# EAGLE design BLE (EAGLE 7.6.0)
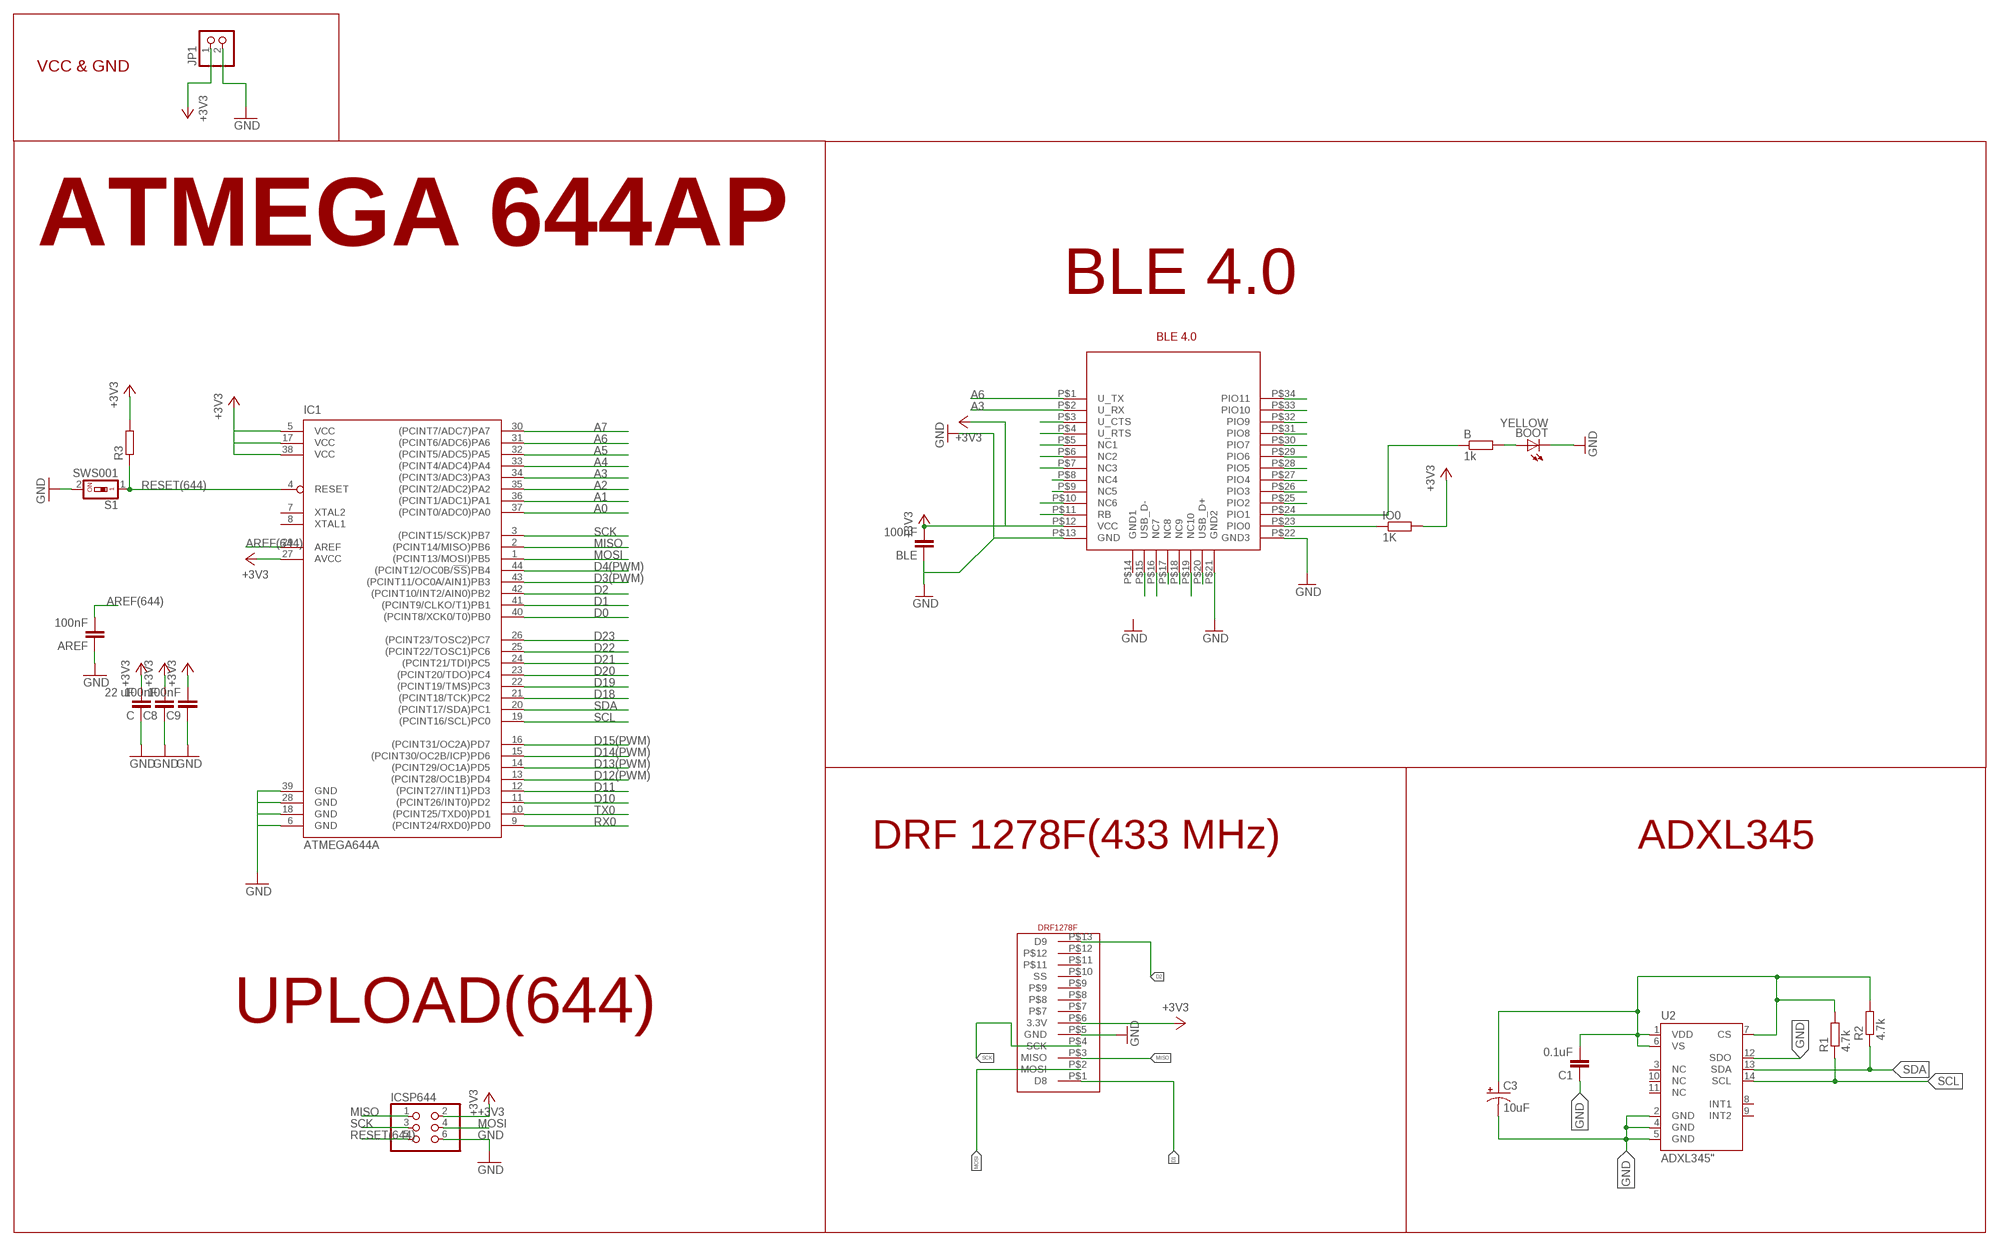
[diagram p0: schematic, sheet 1]

## Parts
AREF  100nF  C-EUC0805  [C0805]
B  1k  R-EU_R0805  [R0805]
BLE  100nF  C-EUC0805  [C0805]
BOOT  YELLOW  LEDCHIP-LED0805  [CHIP-LED0805]
C  22 uF  C-EUC0805  [C0805]
C1  0.1uF  C-EUC0805  [C0805]
C3  10uF  CAP_POL1206  [EIA3216]
C8  100nF  C-EUC0805  [C0805]
C9  100nF  C-EUC0805  [C0805]
IC1  ATMEGA644A  [TQFP44]
ICSP644  PINHD-2X3  [2X03]
IO0  1K  R-EU_R0805  [R0805]
JP1  PINHD-1X2  [1X02]
R1  4.7k  R-EU_R0805  [R0805]
R2  4.7k  R-EU_R0805  [R0805]
R3  R-EU_R0805  [R0805]
S1  SWS001  [SMS-001]
U2  ADXL345"  [ADXL3451:1]
U$1  DRF1278F  [DIP13]
U$6  BLUETOOTH_4.0(13)  [BLUTOOTH_4.0(13)]

## Nets
5V_1: B.2 BOOT.A
+3V3: BLE.2 C8.2 C9.2 C.2 IC1.5(VCC) IC1.17(VCC) IC1.27(AVCC) IC1.38(VCC) ICSP644.2 IO0.2 JP1.1 R3.2 U$1.P$6(3.3V) U$6.P$12(VCC)
A0: IC1.37((PCINT0/ADC0)PA0)
A1: IC1.36((PCINT1/ADC1)PA1)
A2: IC1.35((PCINT2/ADC2)PA2)
A3: IC1.34((PCINT3/ADC3)PA3) U$6.P$2(U_RX)
A4: IC1.33((PCINT4/ADC4)PA4)
A5: IC1.32((PCINT5/ADC5)PA5)
A6: IC1.31((PCINT6/ADC6)PA6) U$6.P$1(U_TX)
A7: IC1.30((PCINT7/ADC7)PA7)
AREF(644): AREF.2 IC1.29(AREF)
D0: IC1.40((PCINT8/XCK0/T0)PB0)
D1: IC1.41((PCINT9/CLKO/T1)PB1) U$1.P$1(D8)
D2: IC1.42((PCINT10/INT2/AIN0)PB2) U$1.P$13(D9)
D3(PWM): IC1.43((PCINT11/OC0A/AIN1)PB3)
D4(PWM): IC1.44((PCINT12/OC0B/!SS!)PB4)
D10: IC1.11((PCINT26/INT0)PD2)
D11: IC1.12((PCINT27/INT1)PD3)
D12(PWM): IC1.13((PCINT28/OC1B)PD4)
D13(PWM): IC1.14((PCINT29/OC1A)PD5)
D14(PWM): IC1.15((PCINT30/OC2B/ICP)PD6)
D15(PWM): IC1.16((PCINT31/OC2A)PD7)
D18: IC1.21((PCINT18/TCK)PC2)
D19: IC1.22((PCINT19/TMS)PC3)
D20: IC1.23((PCINT20/TDO)PC4)
D21: IC1.24((PCINT21/TDI)PC5)
D22: IC1.25((PCINT22/TOSC1)PC6)
D23: IC1.26((PCINT23/TOSC2)PC7)
GND: AREF.1 BLE.1 BOOT.C C1.1 C3.C(-) C8.1 C9.1 C.1 IC1.6(GND) IC1.18(GND) IC1.28(GND) IC1.39(GND) ICSP644.6 JP1.2 S1.2 U2.2(GND) U2.4(GND) U2.5(GND) U2.12(SDO) U$1.P$5(GND) U$6.P$13(GND) U$6.P$21(GND2) U$6.P$22(GND3)
MISO: IC1.2((PCINT14/MISO)PB6) ICSP644.1 U$1.P$3(MISO)
MOSI: IC1.1((PCINT13/MOSI)PB5) ICSP644.4 U$1.P$2(MOSI)
N$3: U$6.P$3(U_CTS)
N$6: C1.2 C3.A(+) R1.2 R2.2 U2.1(VDD) U2.6(VS) U2.7(CS)
N$14: U$6.P$4(U_RTS)
N$28: U$6.P$5(NC1)
N$32: U$6.P$6(NC2)
N$33: U$6.P$7(NC3)
N$34: U$6.P$8(NC4)
N$35: U$6.P$9(NC5)
N$37: U$6.P$10(NC6)
N$38: U$6.P$11(RB)
N$41: U$6.P$15(USB_D-)
N$45: U$6.P$16(NC7)
N$46: U$6.P$17(NC8)
N$47: U$6.P$18(NC9)
N$48: U$6.P$19(NC10)
N$49: U$6.P$20(USB_D+)
N$50: IO0.1 U$6.P$23(PIO0)
N$51: B.1 U$6.P$24(PIO1)
N$52: U$6.P$25(PIO2)
N$53: U$6.P$26(PIO3)
N$54: U$6.P$27(PIO4)
N$55: U$6.P$28(PIO5)
N$56: U$6.P$29(PIO6)
N$57: U$6.P$30(PIO7)
N$58: U$6.P$31(PIO8)
N$59: U$6.P$32(PIO9)
N$60: U$6.P$33(PIO10)
N$61: U$6.P$34(PIO11)
RESET(644): IC1.4(RESET) ICSP644.5 R3.1 S1.1
RX0: IC1.9((PCINT24/RXD0)PD0)
SCK: IC1.3((PCINT15/SCK)PB7) ICSP644.3 U$1.P$4(SCK)
SCL: IC1.19((PCINT16/SCL)PC0) R1.1 U2.14(SCL)
SDA: IC1.20((PCINT17/SDA)PC1) R2.1 U2.13(SDA)
TX0: IC1.10((PCINT25/TXD0)PD1)
Unconnected: IC1.7(XTAL2) IC1.8(XTAL1) U2.3(NC) U2.8(INT1) U2.9(INT2) U2.10(NC) U2.11(NC) U$1.P$7 U$1.P$8 U$1.P$9 U$1.P$10(SS) U$1.P$11 U$1.P$12 U$6.P$14(GND1)

## Notes on the sheet
- VCC & GND
- ATMEGA 644AP
- BLE 4.0
- DRF 1278F(433 MHz) | ADXL345
- UPLOAD(644)

## Library data of the parts
AREF BLE C C1 C8 C9 = rcl:C-EU: CAPACITOR, European symbol
B IO0 R1-R3 = resistor:R-EU_: RESISTOR, European symbol
BOOT = led:LED: LED OSRAM: - CHIPLED LG R971, LG N971, LY N971, LG Q971, LY Q971, LO R971, LY R971 LH N974, LH R974 LS Q976, LO Q976, LY Q976 LO Q996 - Hyper CHIPLED LW Q18S LB Q993, LB Q99A, LB R99A - SideLED LS A670, LO A670, LY A670, LG A670, LP A670 LB A673, LV A673, LT A673, LW A673 LH A674 LY A675 LS A676, LA A676, LO A676, LY A676, LW A676 LS A679, LY A679, LG A679 - Hyper Micro SIDELED® LS Y876, LA Y876, LO Y876, LY Y876 LT Y87S - SmartLED LW L88C, LW L88S LB L89C, LB L89S, LG L890 LS L89K, LO L89K, LY L89K LS L896, LA L896, LO L896, LY L896 - TOPLED LS T670, LO T670, LY T670, LG T670, LP T670 LSG T670, LSP T670, LSY T670, LOP T670, LYG T670 LG T671, LOG T671, LSG T671 LB T673, LV T673, LT T673, LW T673 LH T674 LS T676, LA T676, LO T676, LY T676, LB T676, LH T676, LSB T676, LW T676 LB T67C, LV T67C, LT T67C, LS T67K, LO T67K, LY T67K, LW E67C LS E67B, LA E67B, LO E67B, LY E67B, LB E67C, LV E67C, LT E67C LW T67C LS T679, LY T679, LG T679 LS T770, LO T770, LY T770, LG T770, LP T770 LB T773, LV T773, LT T773, LW T773 LH T774 LS E675, LA E675, LY E675, LS T675 LS T776, LA T776, LO T776, LY T776, LB T776 LHGB T686 LT T68C, LB T68C - Hyper Mini TOPLED® LB M676 - Mini TOPLED Santana® LG M470 LS M47K, LO M47K, LY M47K Source: http://www.osram.convergy.de LUXEON: - LUMILED® LXK2-PW12-R00, LXK2-PW12-S00, LXK2-PW14-U00, LXK2-PW14-V00 LXK2-PM12-R00, LXK2-PM12-S00, LXK2-PM14-U00 LXK2-PE12-Q00, LXK2-PE12-R00, LXK2-PE12-S00, LXK2-PE14-T00, LXK2-PE14-U00 LXK2-PB12-K00, LXK2-PB12-L00, LXK2-PB12-M00, LXK2-PB14-N00, LXK2-PB14-P00, LXK2-PB14-Q00 LXK2-PR12-L00, LXK2-PR12-M00, LXK2-PR14-Q00, LXK2-PR14-R00 LXK2-PD12-Q00, LXK2-PD12-R00, LXK2-PD12-S00 LXK2-PH12-R00, LXK2-PH12-S00 LXK2-PL12-P00, LXK2-PL12-Q00, LXK2-PL12-R00 Source: www.luxeon.com KINGBRIGHT: KA-3528ASYC Source: www.kingbright.com
C3 = SparkFun:CAP_POL: Capacitor Polarized These are standard SMD and PTH capacitors. Normally 10uF, 47uF, and 100uF in electrolytic and tantalum varieties. Always verify the external diameter of the through hole cap, it varies with capacity, voltage, and manufacturer. The EIA devices should be standard.
IC1 = atmel:ATMEGA644: 8-bit Microcontroller with 64K Bytes In-System Programmable Flash Source: http://www.atmel.com/dyn/resources/prod_documents/doc2593.pdf; MPN: ATMEGA644PV-10AU; OC_FARNELL: 1455123; OC_NEWARK: 58M3748
ICSP644 = pinhead:PINHD-2X3: PIN HEADER
JP1 = pinhead:PINHD-1X2: PIN HEADER
S1 = smd-special:SWS001: SMD Dip Switch 1 pol.
U2 = SparkFun-Sensors:ADXL345: 3-axis SPI/I2C 2/4/8/16g accelerometer; PROD_ID: IC-09097
U$1 = small_header:DRF1278F
U$6 = BLUETOOTH_4.0(13P):BLUETOOTH_4.0(13)

## Board
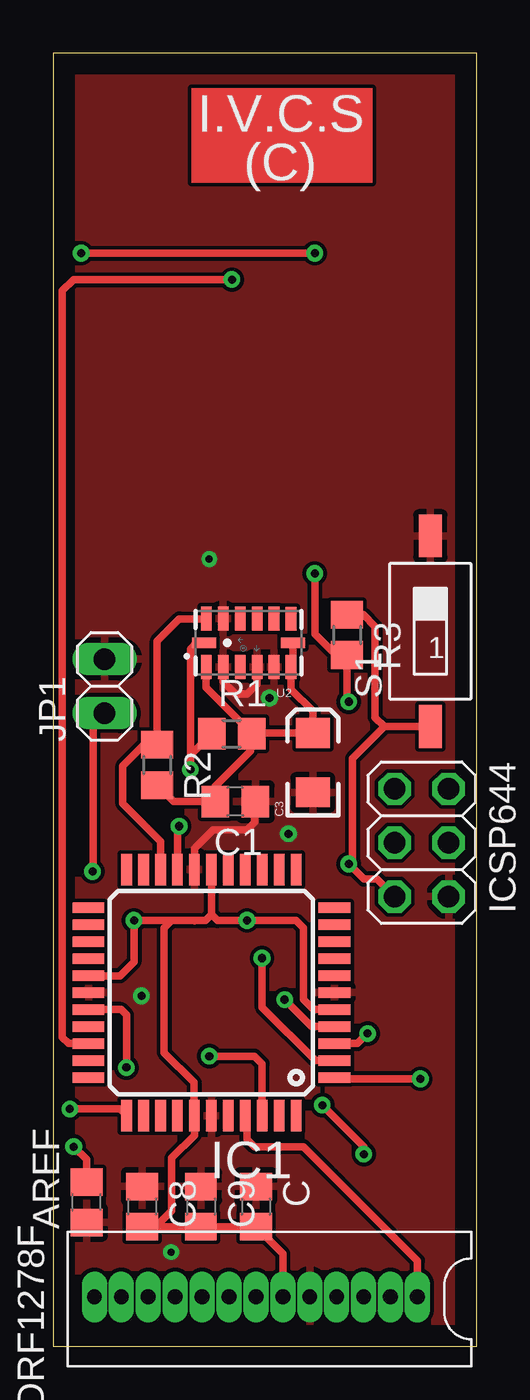
[diagram p1: board, top side]
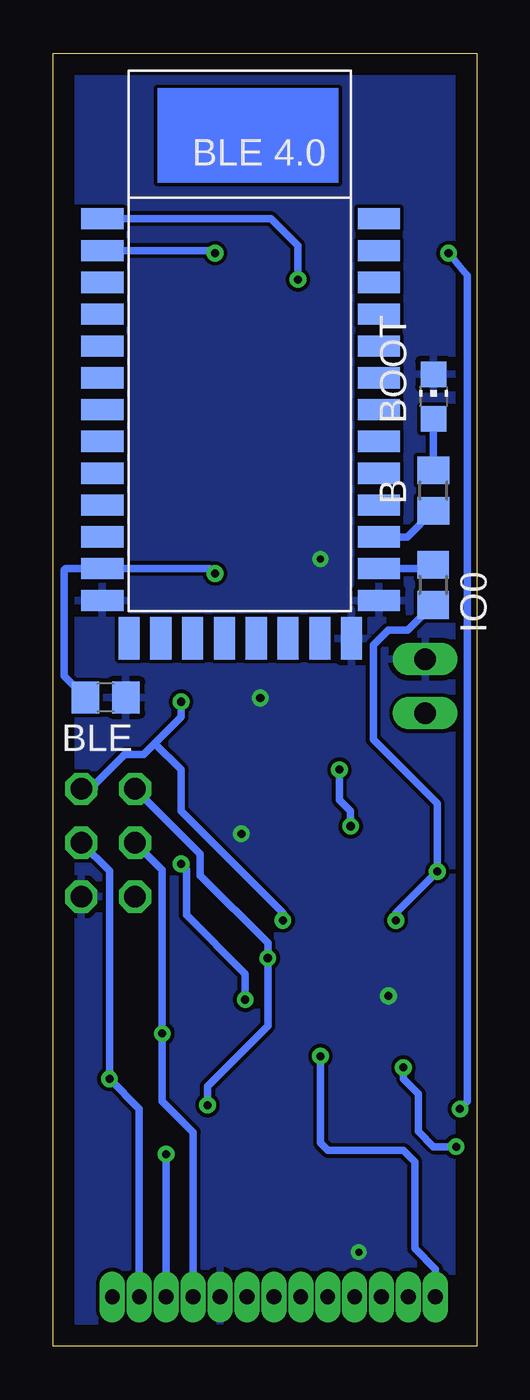
[diagram p2: board, bottom side, seen from below]

Size 20 x 61 mm. Coordinates in mm from the lower left corner, seen from the top.
Outline: 20,0 20,61 0,61 0,0 20,0
Copper layers (1*16): Top 0.035mm / dielectric 1.5mm / Bottom 0.035mm
Design rules "default *": minimum track width 10mil, minimum drill 13mil, track to track 7mil, track to pad 7mil, pad to pad 7mil, via to via 7mil, smd to smd 7mil, copper to edge 40mil, drill to drill 8mil, minimum pad ring 10mil, minimum via ring 8mil, stop-mask expansion 4mil, vias tented up to drill 0mil, thermal gap 10mil

### Footprints (pad centres in the part's own frame; a part is rotated, then mirrored left to right if it is on the bottom)
C0805 = smd 1.3 x 1.5: 1 -0.95,0; 2 0.95,0
R0805 = smd 1.3 x 1.5: 1 -0.95,0; 2 0.95,0
CHIP-LED0805 = smd 1.2 x 1.2: A 0,-1.05; C 0,1.05
EIA3216 = smd 1.4 x 1.6: A 1.4,0; C -1.4,0
TQFP44 = smd 1.5 x 0.5: 1 -5.8,4; 2 -5.8,3.2; 3 -5.8,2.4; 4 -5.8,1.6; 5 -5.8,0.8; 6 -5.8,0; 7 -5.8,-0.8; 8 -5.8,-1.6; 9 -5.8,-2.4; 10 -5.8,-3.2; 11 -5.8,-4; 23 5.8,-4; 24 5.8,-3.2; 25 5.8,-2.4; 26 5.8,-1.6; 27 5.8,-0.8; 28 5.8,0; 29 5.8,0.8; 30 5.8,1.6; 31 5.8,2.4; 32 5.8,3.2; 33 5.8,4 | smd 0.5 x 1.5: 12 -4,-5.8; 13 -3.2,-5.8; 14 -2.4,-5.8; 15 -1.6,-5.8; 16 -0.8,-5.8; 17 0,-5.8; 18 0.8,-5.8; 19 1.6,-5.8; 20 2.4,-5.8; 21 3.2,-5.8; 22 4,-5.8; 34 4,5.8; 35 3.2,5.8; 36 2.4,5.8; 37 1.6,5.8; 38 0.8,5.8; 39 0,5.8; 40 -0.8,5.8; 41 -1.6,5.8; 42 -2.4,5.8; 43 -3.2,5.8; 44 -4,5.8
2X03 = drill 1.016 octagon: 1 -2.54,-1.27; 2 -2.54,1.27; 3 0,-1.27; 4 0,1.27; 5 2.54,-1.27; 6 2.54,1.27
1X02 = drill 1.016 long: 1 -1.27,0; 2 1.27,0
SMS-001 = smd 1.092 x 2.007: 1 0,-4.496; 2 0,4.496
ADXL3451:1 = smd 0.5 x 1.124: 1 2,1.138; 2 1.2,1.138; 3 0.4,1.138; 4 -0.4,1.138; 5 -1.2,1.138; 6 -2,1.138; 8 -2,-1.13; 9 -1.2,-1.138; 10 -0.4,-1.138; 11 0.4,-1.138; 12 1.2,-1.138; 13 2,-1.138 | smd 1.124 x 0.5: 7 -2.1,0; 14 2.1,0
DIP13 = drill 0.7 long: P$1 -2,0; P$2 -2,-1.27; P$3 -2,-2.54; P$4 -2,-3.81; P$5 -2,-5.08; P$6 -2,-6.35; P$7 -2,-7.62; P$8 -2,-8.89; P$9 -2,-10.16; P$10 -2,-11.43; P$11 -2,-12.7; P$12 -2,-13.97; P$13 -2,-15.24
BLUTOOTH_4.0(13) = smd 2 x 1: P$1 -4.5,0; P$2 -4.5,-1.5; P$3 -4.5,-3; P$4 -4.5,-4.5; P$5 -4.5,-6; P$6 -4.5,-7.5; P$7 -4.5,-9; P$8 -4.5,-10.5; P$9 -4.5,-12; P$10 -4.5,-13.5; P$11 -4.5,-15; P$12 -4.5,-16.5; P$13 -4.5,-18; P$22 8.557,-18; P$23 8.557,-16.5; P$24 8.557,-15; P$25 8.557,-13.5; P$26 8.557,-12; P$27 8.557,-10.5; P$28 8.557,-9; P$29 8.557,-7.5; P$30 8.557,-6; P$31 8.557,-4.5; P$32 8.557,-3; P$33 8.557,-1.5; P$34 8.557,0 | smd 1 x 2: P$14 -3.23,-19.79; P$15 -1.73,-19.79; P$16 -0.23,-19.79; P$17 1.27,-19.79; P$18 2.77,-19.79; P$19 4.27,-19.79; P$20 5.77,-19.79; P$21 7.257,-19.79

### Placement (x,y rotation side)
AREF  1.58,6.8 90 top
B  2.05,40.36 90 bottom
BLE  17.51,30.6 180 bottom
BOOT  2.04,44.81 0 bottom
C  9.57,6.6 270 top
C1  8.6,25.69 180 top
C3  12.26,27.53 90 top
C8  4.2,6.6 270 top
C9  6.98,6.6 270 top
IC1  7.48,16.69 180 top
ICSP644  17.4,23.76 270 top
IO0  2.06,35.92 270 bottom
JP1  2.43,31.14 90 top
R1  8.43,28.9 0 top
R2  4.92,27.42 270 top
R3  13.87,33.56 270 top
S1  17.81,33.73 0 top
U2  9.23,33.19 180 top
U$1  17.2,0.34 270 top
U$6  13.18,53.18 0 bottom

### Tracks (layer width: path | path; a pad name or v marks a point on that pad's centre or on a via)
5V_1
  Bottom 0.356: B.2 BOOT.A
+3V3  (via drill 0.38)
  Top 0.356: IC1.27 3.17,17.49 3.82,18.14 v3.82,20.09 5.6,20.09 | 5.6,20.09 6.67,20.09 | 6.67,20.09 7.2,20.09 7.48,20.37 | 7.48,20.37 IC1.17 | 6.68,20.08 6.67,20.09 | U$1.P$6 10.85,4.38 C.2 C9.2 C8.2 4.84,5.65 5.6,6.4 5.6,8.89 6.68,9.97 IC1.38 6.67,10.9 6.67,12.45 5.25,13.86 5.25,19.75 5.6,20.09 | v13.96,30.4 13.87,30.48 R3.2 13.35,32.61 12.36,33.6 v12.36,36.45 | IC1.5 12.29,15.89 11.82,16.36 11.82,19.74 11.47,20.09 v9.15,20.09 7.75,20.09 7.48,20.37 | v1.86,22.4 1.9,22.44 1.9,29.34 JP1.1
  Bottom 0.356: ICSP644.2 18.06,26.3 18.06,26.47 16.62,27.91 15.73,27.91 15.2,28.45 | v13.96,30.4 13.96,29.69 15.2,28.45 | v9.15,20.09 9.15,20.45 13.96,25.25 13.96,27.2 15.2,28.45 | v3.82,20.09 3.82,20.45 v1.86,22.4 1.86,25.6 4.89,28.63 4.89,33.07 4.18,33.78 3.25,33.78 IO0.2 | v12.36,36.45 12.59,36.68 U$6.P$12 19.41,36.68 19.47,36.63 19.47,31.61 BLE.2
A3  (via drill 0.38)
  Top 0.356: v1.33,51.56 v12.36,51.56 | v0.8,11.2 3.16,11.2 IC1.34
  Bottom 0.356: v12.36,51.56 arc-90 12.47,51.68 U$6.P$2 | v0.8,11.2 0.44,11.56 0.44,50.49 v1.33,51.56
A6  (via drill 0.38)
  Top 0.356: v8.44,50.32 0.97,50.32 0.44,49.78 0.44,14.58 0.73,14.29 IC1.31
  Bottom 0.356: v8.44,50.32 8.44,51.92 9.71,53.18 U$6.P$1
AREF(644)  (via drill 0.38)
  Top 0.356: v3.46,13.16 3.46,15.65 3.22,15.89 IC1.29 | AREF.2 1.58,8.82 v0.97,9.42
  Bottom 0.356: v3.46,13.16 3.46,12.62 2.75,11.91 2.75,10.13 2.04,9.42 v0.97,9.42
D1
  Top 0.356: U$1.P$1 17.2,4.05 11.82,9.42 9.51,9.42 9.15,9.78 9.15,10.81 IC1.41
D2  (via drill 0.38)
  Top 0.356: IC1.42 9.87,10.9 9.87,13.34 9.51,13.69 v7.38,13.69
  Bottom 0.356: U$1.P$13 1.96,3.65 2.93,4.62 2.93,8.71 3.46,9.25 7.02,9.25 7.38,9.6 v7.38,13.69
GND  (via drill 0.33, 0.38)
  Top 0.356: IC1.18 6.68,23.48 7.55,24.36 9.15,24.36 9.51,24.71 9.51,25.65 C1.1 | U2.4 9.63,31.24 9.15,30.76 8.62,30.76 8.03,31.35 U2.2
  other vias: 7.38,37.13 5.57,4.45 11.11,24.18 4.18,16.54 10.22,30.58
  pour Top: 0.09,0.53 20,0.53 20,60.77 0.09,60.77
  pour Bottom: 0.09,0.18 0.09,60.6 20,60.6 20,0.18
MISO  (via drill 0.38)
  Top 0.356: v14.67,9.07 14.67,9.42 v12.71,11.38 | IC1.2 12.38,13.49 9.87,16 v9.87,18.31
  Bottom 0.356: U$1.P$3 14.66,9.06 v14.67,9.07 | ICSP644.1 13.07,23.23 13.07,22.23 9.87,19.02 v9.87,18.31 9.87,15.11 12.71,12.27 v12.71,11.38
MOSI  (via drill 0.38)
  Top 0.356: v17.33,12.62 13.34,12.62 IC1.1
  Bottom 0.356: ICSP644.4 17.33,22.42 v17.33,12.62 15.93,11.22 U$1.P$2
N$6
  Top 0.305: R1.2 9.38,29.11
  Top 0.356: R2.2 5.7,25.69 C1.2 7.65,26.41 9.33,28.09 9.33,28.84 R1.2 9.42,28.93 C3.A 12.26,29.97 11.23,30.99 U2.6 11.33,32.15 U2.7 | 9.38,29.11 9.21,29.11 7.23,31.08 U2.1
N$50
  Bottom 0.356: U$6.P$23 2.25,36.68 IO0.1
N$51
  Bottom 0.356: U$6.P$24 3.27,38.18 B.1
RESET(644)  (via drill 0.38)
  Top 0.356: S1.1 15.63,29.24 | 15.63,29.24 14.13,27.74 14.13,22.76 v13.96,22.76 14.67,22.05 15.3,22.05 ICSP644.5 | 13.25,15.11 IC1.4 12.2,15.09 v10.93,16.36 | R3.1 14.65,34.51 15.2,33.96 15.2,29.67 15.63,29.24
  Bottom 0.356: v10.93,16.36 10.93,17.58 13.7,20.34 13.7,22.5 v13.96,22.76
SCK  (via drill 0.38)
  Top 0.356: v14.84,14.76 14.38,14.29 IC1.3
  Bottom 0.356: ICSP644.3 14.84,22.47 v14.84,14.76 14.84,11.56 13.39,10.1 U$1.P$4
SCL  (via drill 0.38)
  Top 0.356: R1.1 6.49,27.9 | 6.49,27.9 v6.49,27.2 | U2.14 6.78,33.19 6.49,32.89 6.49,27.9 | IC1.19 5.88,24.46 v5.95,24.54
  Bottom 0.356: v5.95,24.54 5.95,25.25 6.49,25.78 v6.49,27.2
SDA
  Top 0.356: U2.13 7.22,34.31 5.95,34.31 4.92,33.28 R2.1 4.28,28.37 3.29,27.38 3.29,25.6 5.08,23.81 IC1.20
(copper drawn outside any net)
  shapes: Bottom area x1, Top area x1

### Text on the board
tPlace: I.V.C.S | (C)